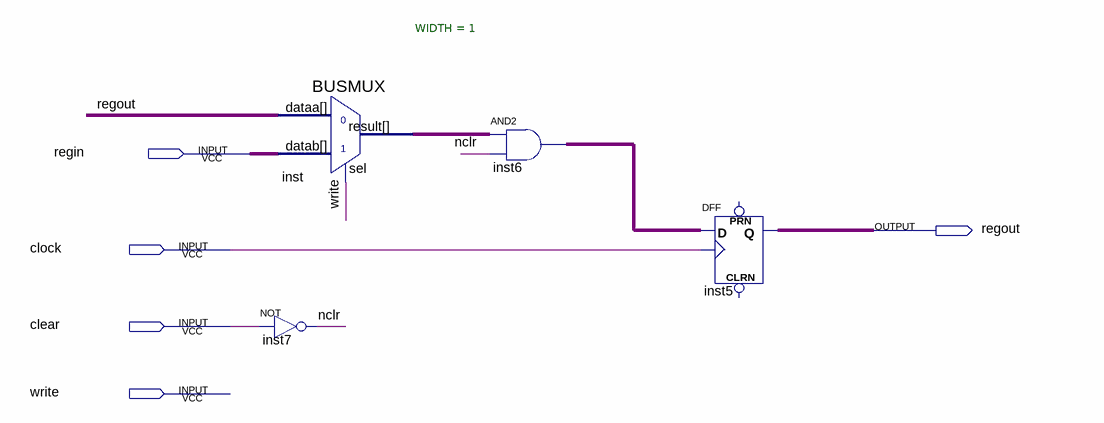
[diagram p0: schematic sheet]
// Quartus schematic Register1.bdf as structural Verilog: 4 symbols, 5 pins
module Register1 (
  input  regin,
  input  clock,
  input  clear,
  input  write,
  output regout
);

  wire inst6_out, inst_result, nclr;

  not inst7 (nclr, clear);
  BUSMUX #(.WIDTH(1)) inst (.datab(regin), .sel(write), .dataa(regout), .result(inst_result));
  and inst6 (inst6_out, inst_result, nclr);
  DFF inst5 (.CLK(clock), .D(inst6_out), .Q(regout));  // open: CLRN, PRN
endmodule
